# EAGLE design sensor_pa1 (EAGLE 4.13)
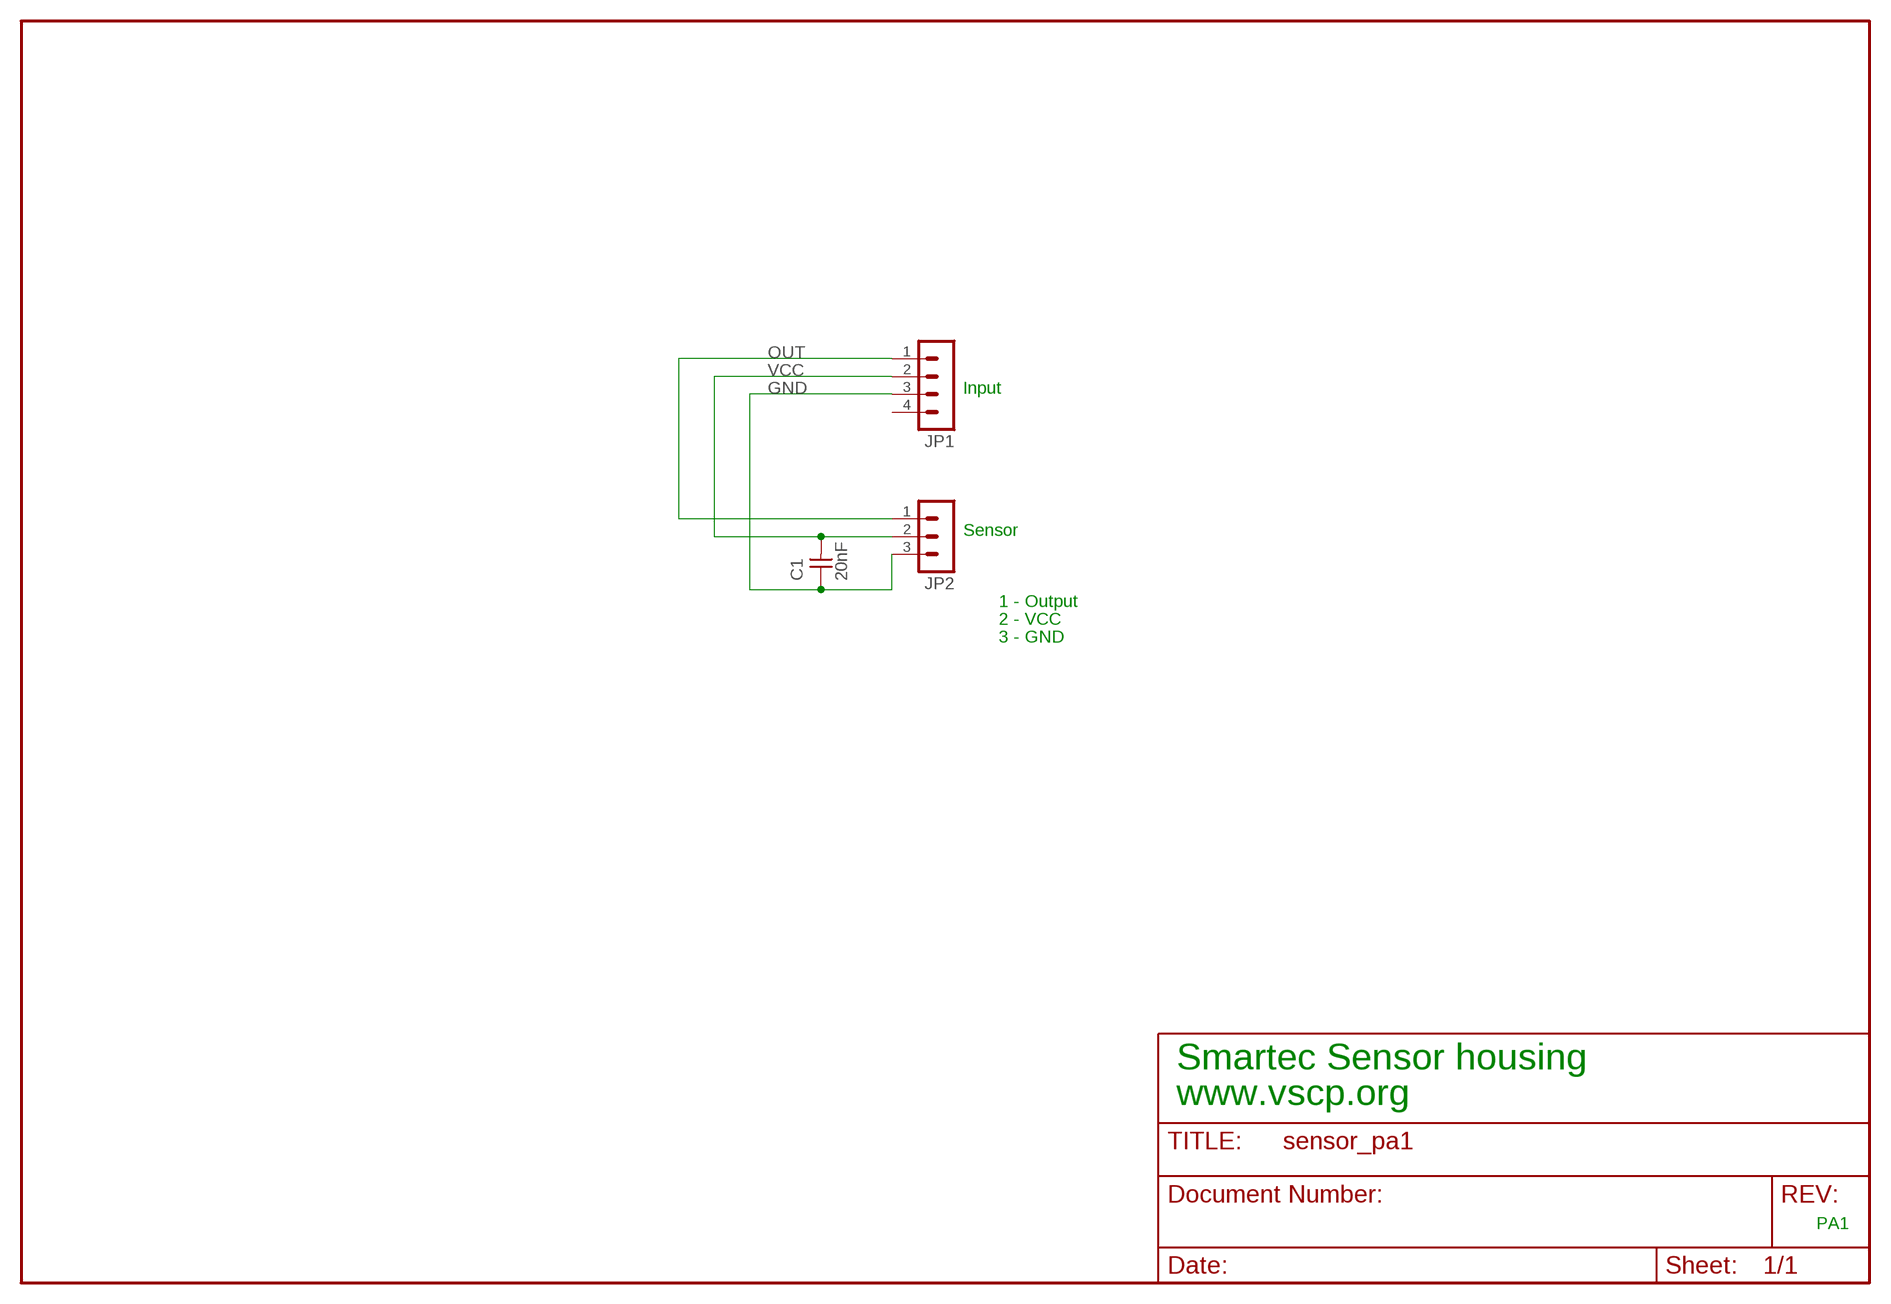
[diagram p0: schematic, sheet 1]

## Parts
C1  20nF  CAPNP-2,5  [C-2,5]
JP1  MA04-1  [MA04-1]
JP2  MA03-1  [MA03-1]

## Nets
GND: C1.1 JP1.3 JP2.3
OUT: JP1.1 JP2.1
VCC: C1.2 JP1.2 JP2.2
Unconnected: JP1.4

## Notes on the sheet
- Input
- Sensor
- 1 - Output
- 2 - VCC
- 3 - GND
- Smartec Sensor housing
- www.vscp.org
- PA1

## Library data of the parts
C1 = discrete:CAPNP-2,5
JP1 = con-lstb:MA04-1: PIN HEADER
JP2 = con-lstb:MA03-1: PIN HEADER

## Board
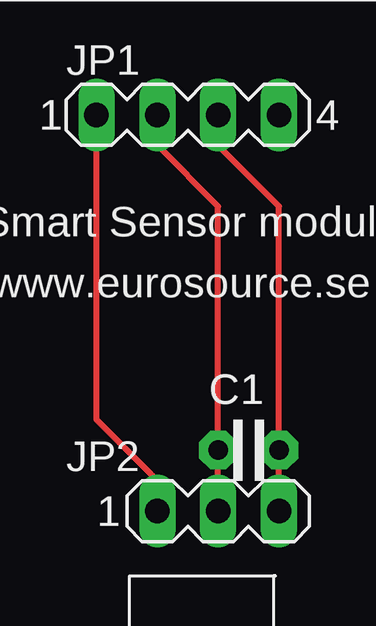
[diagram p1: board, top side]

No outline drawn. Coordinates in mm, seen from the top.
Copper layers (1*16): Top 0.035mm / dielectric 1.5mm / Bottom 0.035mm
Design rules "10mils": minimum track width 10mil, minimum drill 24mil, track to track 10mil, track to pad 10mil, pad to pad 10mil, via to via 10mil, smd to smd 10mil, copper to edge 40mil, drill to drill 10mil, minimum pad ring 10mil, minimum via ring 8mil, stop-mask expansion 0mil, vias tented up to drill 0mil, thermal gap 10mil

### Footprints (pad centres in the part's own frame; a part is rotated, then mirrored left to right if it is on the bottom)
C-2,5 = drill 0.813 pad 1.6 octagon: 1 -1.27,0; 2 1.27,0
MA04-1 = drill 1.016 long: 1 -3.81,0; 2 -1.27,0; 3 1.27,0; 4 3.81,0
MA03-1 = drill 1.016 long: 1 -2.54,0; 2 0,0; 3 2.54,0
LILLA_RJ11_KONTAKTEN = hole 2: 2.5,15; 21.5,15

### Placement (x,y rotation side)
C1  13.97,15.24 180 top
JP1  11.43,29.21 0 top
JP2  12.7,12.7 0 top
U$1  [LILLA_RJ11_KONTAKTEN]  0,0 0 top

### Tracks (layer width: path | path; a pad name or v marks a point on that pad's centre or on a via)
GND
  Top 0.254: JP1.3 12.7,27.94 15.24,25.4 C1.1 JP2.3
OUT
  Top 0.254: JP2.1 10.16,13.97 7.62,16.51 JP1.1
VCC
  Top 0.254: JP1.2 10.16,27.94 12.7,25.4 C1.2 JP2.2

### Text on the board
tNames: Smart Sensor module | www.eurosource.se | PA1